# EAGLE design cvsource (EAGLE 7.2.0)
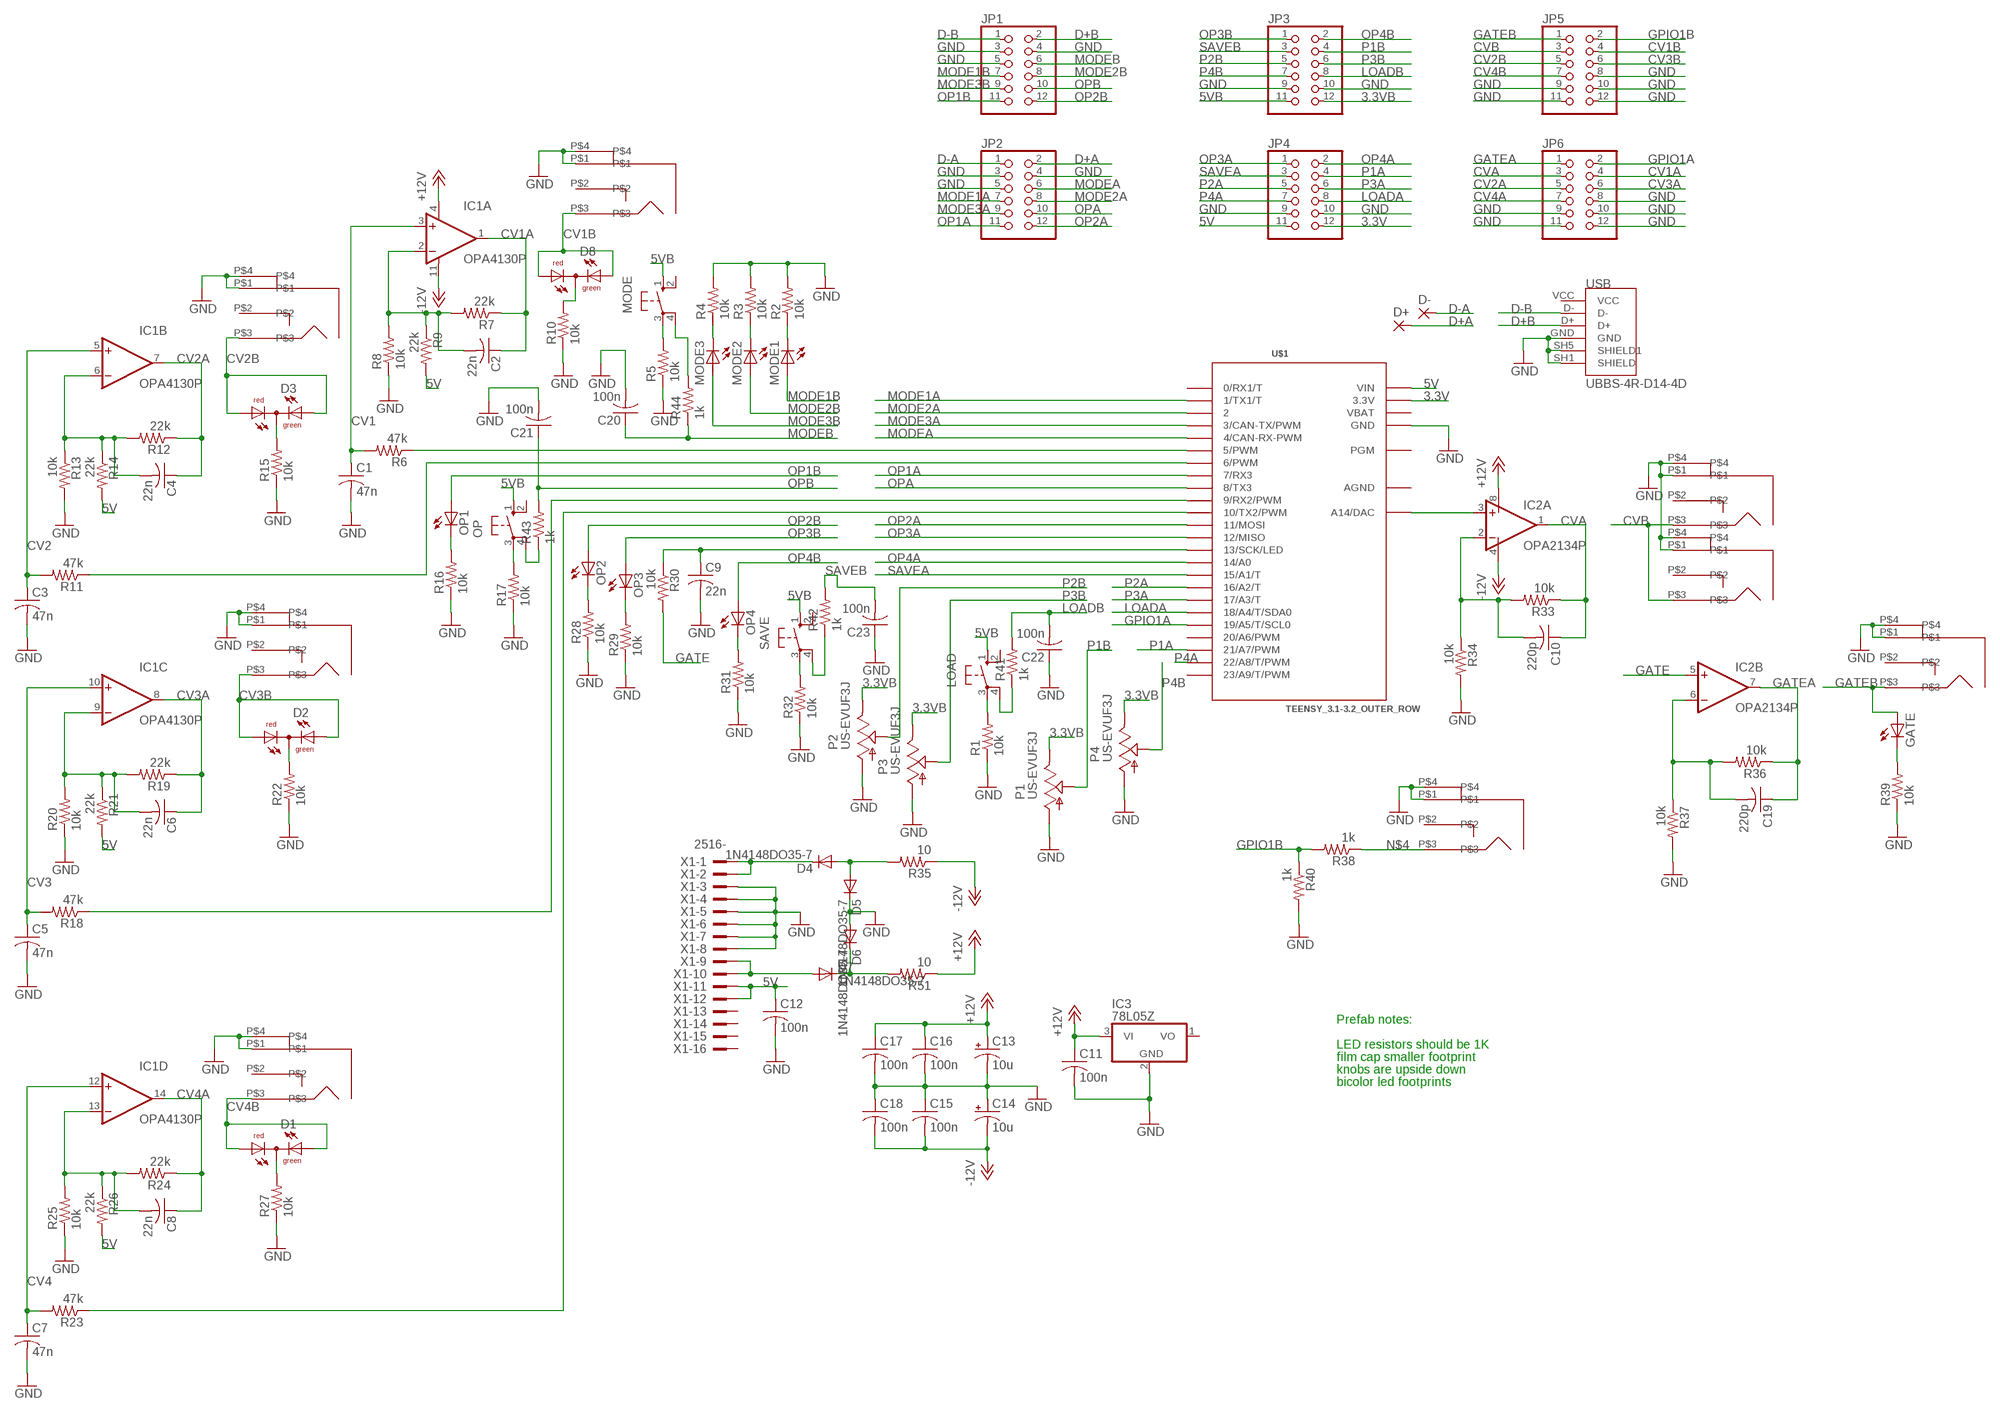
[diagram p0: schematic, sheet 1]

## Parts
C1  47n  C-US075-032X103  [C075-032X103]
C2  22n  C-US075-032X103  [C075-032X103]
C3  47n  C-US075-032X103  [C075-032X103]
C4  22n  C-US075-032X103  [C075-032X103]
C5  47n  C-US075-032X103  [C075-032X103]
C6  22n  C-US075-032X103  [C075-032X103]
C7  47n  C-US075-032X103  [C075-032X103]
C8  22n  C-US075-032X103  [C075-032X103]
C9  22n  C-US075-032X103  [C075-032X103]
C10  220p  C-US075-032X103  [C075-032X103]
C11  100n  C-US075-032X103  [C075-032X103]
C12  100n  C-US075-032X103  [C075-032X103]
C13  10u  CPOL-USE5-10.5  [E5-10,5]
C14  10u  CPOL-USE5-10.5  [E5-10,5]
C15  100n  C-US075-032X103  [C075-032X103]
C16  100n  C-US075-032X103  [C075-032X103]
C17  100n  C-US075-032X103  [C075-032X103]
C18  100n  C-US075-032X103  [C075-032X103]
C19  220p  C-US075-032X103  [C075-032X103]
C20  100n  C-US075-032X103  [C075-032X103]
C21  100n  C-US075-032X103  [C075-032X103]
C22  100n  C-US075-032X103  [C075-032X103]
C23  100n  C-US075-032X103  [C075-032X103]
CVOUT  PJ301BM  [PJ301BM]
CVOUT1  PJ301BM  [PJ301BM]
CVOUT2  PJ301BM  [PJ301BM]
CVOUT3  PJ301BM  [PJ301BM]
CVOUT4  PJ301BM  [PJ301BM]
CVOUT5  PJ301BM  [PJ301BM]
CVOUT6  PJ301BM  [PJ301BM]
CVOUT7  PJ301BM  [PJ301BM]
D1  DUOLED5MM  [DUOLED5MM]
D2  DUOLED5MM  [DUOLED5MM]
D3  DUOLED5MM  [DUOLED5MM]
D4  1N4148DO35-7  [DO35-7]
D5  1N4148DO35-7  [DO35-7]
D6  1N4148DO35-7  [DO35-7]
D7  1N4148DO35-7  [DO35-7]
D8  DUOLED5MM  [DUOLED5MM]
D+  2,0/0,9-R  [2,0/0,9-R]
D-  2,0/0,9-R  [2,0/0,9-R]
GATE  LED5MM  [LED5MM]
IC1  OPA4130P  [DIL14]
IC2  OPA2134P  [DIL08]
IC3  78L05Z  [TO92]
JP1  PINHD-2X6  [2X06]
JP2  PINHD-2X6  [2X06]
JP3  PINHD-2X6  [2X06]
JP4  PINHD-2X6  [2X06]
JP5  PINHD-2X6  [2X06]
JP6  PINHD-2X6  [2X06]
LOAD  40-XX  [B3F-40XX]
MODE  40-XX  [B3F-40XX]
MODE1  LED5MM  [LED5MM]
MODE2  LED5MM  [LED5MM]
MODE3  LED5MM  [LED5MM]
OP  40-XX  [B3F-40XX]
OP1  LED5MM  [LED5MM]
OP2  LED5MM  [LED5MM]
OP3  LED5MM  [LED5MM]
OP4  LED5MM  [LED5MM]
P1  US-EVUF3J  [EVUFXJ]
P2  US-EVUF3J  [EVUFXJ]
P3  US-EVUF3J  [EVUFXJ]
P4  US-EVUF3J  [EVUFXJ]
R1  10k  R-US_0207/2V  [0207/2V]
R2  10k  R-US_0207/2V  [0207/2V]
R3  10k  R-US_0207/2V  [0207/2V]
R4  10k  R-US_0207/2V  [0207/2V]
R5  10k  R-US_0207/2V  [0207/2V]
R6  47k  R-US_0207/2V  [0207/2V]
R7  22k  R-US_0207/2V  [0207/2V]
R8  10k  R-US_0207/2V  [0207/2V]
R9  22k  R-US_0207/2V  [0207/2V]
R10  10k  R-US_0207/2V  [0207/2V]
R11  47k  R-US_0207/2V  [0207/2V]
R12  22k  R-US_0207/2V  [0207/2V]
R13  10k  R-US_0207/2V  [0207/2V]
R14  22k  R-US_0207/2V  [0207/2V]
R15  10k  R-US_0207/2V  [0207/2V]
R16  10k  R-US_0207/2V  [0207/2V]
R17  10k  R-US_0207/2V  [0207/2V]
R18  47k  R-US_0207/2V  [0207/2V]
R19  22k  R-US_0207/2V  [0207/2V]
R20  10k  R-US_0207/2V  [0207/2V]
R21  22k  R-US_0207/2V  [0207/2V]
R22  10k  R-US_0207/2V  [0207/2V]
R23  47k  R-US_0207/2V  [0207/2V]
R24  22k  R-US_0207/2V  [0207/2V]
R25  10k  R-US_0207/2V  [0207/2V]
R26  22k  R-US_0207/2V  [0207/2V]
R27  10k  R-US_0207/2V  [0207/2V]
R28  10k  R-US_0207/2V  [0207/2V]
R29  10k  R-US_0207/2V  [0207/2V]
R30  10k  R-US_0207/2V  [0207/2V]
R31  10k  R-US_0207/2V  [0207/2V]
R32  10k  R-US_0207/2V  [0207/2V]
R33  10k  R-US_0207/2V  [0207/2V]
R34  10k  R-US_0207/2V  [0207/2V]
R35  10  R-US_0207/2V  [0207/2V]
R36  10k  R-US_0207/2V  [0207/2V]
R37  10k  R-US_0207/2V  [0207/2V]
R38  1k  R-US_0207/2V  [0207/2V]
R39  10k  R-US_0207/2V  [0207/2V]
R40  1k  R-US_0207/2V  [0207/2V]
R41  1k  R-US_0207/2V  [0207/2V]
R42  1k  R-US_0207/2V  [0207/2V]
R43  1k  R-US_0207/2V  [0207/2V]
R44  1k  R-US_0207/2V  [0207/2V]
R51  10  R-US_0207/2V  [0207/2V]
SAVE  40-XX  [B3F-40XX]
U$1  TEENSY_3.1-3.2_OUTER_ROW  [TEENSY_3.0-3.2&LC_OUTER_ROW]
USB  UBBS-4R-D14-4D  [JST_UBBS-4R-D14-4D]
X1  2516-  [PAK100/2500-16]

## Nets
3.3V: JP4.12 U$1.3.3V U$1.3.3V1(3.3V)
3.3VB: JP3.12 P1.3(E) P2.3(E) P3.3(E) P4.3(E)
5V: C12.1 JP4.11 R9.2 R14.2 R21.2 R26.2 U$1.VIN X1.11 X1.12
5VB: JP3.11 LOAD.1(S) MODE.1(S) OP.1(S) SAVE.1(S)
+12V: C11.1 C13.+ C16.1 C17.1 IC1.4(A:V+) IC2.8(P:V+) IC3.3(VI) R51.1
-12V: C14.- C15.2 C18.2 IC1.11(A:V-) IC2.4(P:V-) R35.1
CV1: C1.1 IC1.3(A:+IN) R6.2
CV1A: C2.1 IC1.1(A:OUT) JP6.4 R7.1
CV1B: CVOUT1.P$3 D8.AG D8.AR JP5.4
CV2: C3.1 IC1.5(B:+IN) R11.2
CV2A: C4.1 IC1.7(B:OUT) JP6.5 R12.1
CV2B: CVOUT2.P$3 D3.AG D3.AR JP5.5
CV3: C5.1 IC1.10(C:+IN) R18.2
CV3A: C6.1 IC1.8(C:OUT) JP6.6 R19.1
CV3B: CVOUT3.P$3 D2.AG D2.AR JP5.6
CV4: C7.1 IC1.12(D:+IN) R23.2
CV4A: C8.1 IC1.14(D:OUT) JP6.7 R24.1
CV4B: CVOUT4.P$3 D1.AG D1.AR JP5.7
CVA: C10.1 IC2.1(A:OUT) JP6.3 R33.1
CVB: CVOUT6.P$3 CVOUT.P$3 JP5.3
D+A: D+.1(P) JP2.2
D+B: JP1.2 USB.D+
D-A: D-.1(P) JP2.1
D-B: JP1.1 USB.D-
GATE: IC2.5(B:+IN) R30.2
GATEA: C19.1 IC2.7(B:OUT) JP6.1 R36.1
GATEB: CVOUT5.P$3 GATE.A JP5.1
GND: C1.2 C3.2 C5.2 C7.2 C9.2 C11.2 C12.2 C13.- C14.+ C15.1 C16.2 C17.2 C18.1 C20.2 C21.2 C22.1 C23.1 CVOUT1.P$1 CVOUT1.P$4 CVOUT2.P$1 CVOUT2.P$4 CVOUT3.P$1 CVOUT3.P$4 CVOUT4.P$1 CVOUT4.P$4 CVOUT5.P$1 CVOUT5.P$4 CVOUT6.P$1 CVOUT6.P$4 CVOUT7.P$1 CVOUT7.P$4 CVOUT.P$1 CVOUT.P$4 D5.C D6.A IC3.2(GND) JP1.3 JP1.4 JP1.5 JP2.3 JP2.4 JP2.5 JP3.9 JP3.10 JP4.9 JP4.10 JP5.8 JP5.9 JP5.10 JP5.11 JP5.12 JP6.8 JP6.9 JP6.10 JP6.11 JP6.12 P1.1(A) P2.1(A) P3.1(A) P4.1(A) R1.1 R2.2 R3.2 R4.2 R5.1 R8.1 R10.1 R13.2 R15.1 R16.1 R17.1 R20.1 R22.1 R25.1 R27.1 R28.1 R29.1 R31.1 R32.1 R34.2 R37.2 R39.1 R40.2 U$1.GND U$1.GND1(GND) USB.GND USB.SH1(SHIELD) USB.SH5(SHIELD1) X1.3 X1.4 X1.5 X1.6 X1.7 X1.8
GPIO1A: JP6.2 U$1.19/A5(19/A5/T/SCL0)
GPIO1B: JP5.2 R38.2 R40.1
LOADA: JP4.8 U$1.18/A4(18/A4/T/SDA0)
LOADB: C22.2 JP3.8 R41.2
MODE1A: JP2.7 U$1.1(1/TX1/T)
MODE1B: JP1.7 MODE1.A
MODE2A: JP2.8 U$1.2
MODE2B: JP1.8 MODE2.A
MODE3A: JP2.9 U$1.3(3/CAN-TX/PWM)
MODE3B: JP1.9 MODE3.A
MODEA: JP2.6 U$1.4(4/CAN-RX-PWM)
MODEB: C20.1 JP1.6 R44.1
N$1: MODE1.K(C) R2.1
N$2: MODE2.K(C) R3.1
N$3: MODE3.K(C) R4.1
N$4: CVOUT7.P$3 R38.1
N$5: C19.2 IC2.6(B:-IN) R36.2 R37.1
N$6: GATE.K(C) R39.2
N$7: LOAD.4(P1) R41.1
N$8: MODE.3(P) R5.2
N$9: R6.1 U$1.5(5/PWM)
N$10: OP1.K(C) R16.2
N$11: C2.2 IC1.2(A:-IN) R7.2 R8.2 R9.1
N$12: R42.1 SAVE.4(P1)
N$13: D8.K(C) R10.2
N$14: R11.1 U$1.6(6/PWM)
N$15: C4.2 IC1.6(B:-IN) R12.2 R13.1 R14.1
N$16: OP.4(P1) R43.1
N$17: D3.K(C) R15.2
N$18: MODE.4(P1) R44.2
N$19: D1.K(C) R27.2
N$20: OP.3(P) R17.2
N$21: R18.1 U$1.9(9/RX2/PWM)
N$22: C6.2 IC1.9(C:-IN) R19.2 R20.2 R21.1
N$24: D2.K(C) R22.2
N$25: OP4.K(C) R31.2
N$26: R23.1 U$1.10(10/TX2/PWM)
N$27: C8.2 IC1.13(D:-IN) R24.2 R25.2 R26.1
N$30: OP2.K(C) R28.2
N$32: OP3.K(C) R29.2
N$34: C9.1 R30.1 U$1.13(13/SCK/LED)
N$37: R32.2 SAVE.3(P)
N$41: LOAD.3(P) R1.2
N$44: IC2.3(A:+IN) U$1.RESET/DAC(A14/DAC)
N$45: C10.2 IC2.2(A:-IN) R33.2 R34.1
N$47: D6.C D7.C R51.2
N$48: D4.A D5.A R35.2
N$71: D7.A X1.9 X1.10
N$72: D4.C X1.1 X1.2
OP1A: JP2.11 U$1.7(7/RX3)
OP1B: JP1.11 OP1.A
OP2A: JP2.12 U$1.11(11/MOSI)
OP2B: JP1.12 OP2.A
OP3A: JP4.1 U$1.12(12/MISO)
OP3B: JP3.1 OP3.A
OP4A: JP4.2 U$1.14/A0
OP4B: JP3.2 OP4.A
OPA: JP2.10 U$1.8(8/TX3)
OPB: C21.1 JP1.10 R43.2
P1A: JP4.4 U$1.21/A7(21/A7/PWM)
P1B: JP3.4 P1.2(S)
P2A: JP4.5 U$1.16/A2(16/A2/T)
P2B: JP3.5 P2.2(S)
P3A: JP4.6 U$1.17/A3(17/A3/T)
P3B: JP3.6 P3.2(S)
P4A: JP4.7 U$1.22/A8(22/A8/T/PWM)
P4B: JP3.7 P4.2(S)
SAVEA: JP4.3 U$1.15/A1(15/A1/T)
SAVEB: C23.2 JP3.3 R42.2
Unconnected: CVOUT1.P$2 CVOUT2.P$2 CVOUT3.P$2 CVOUT4.P$2 CVOUT5.P$2 CVOUT6.P$2 CVOUT7.P$2 CVOUT.P$2 IC3.1(VO) LOAD.2(S1) MODE.2(S1) OP.2(S1) SAVE.2(S1) U$1.0(0/RX1/T) U$1.20/A6(20/A6/PWM) U$1.23/A9(23/A9/T/PWM) U$1.PGM USB.VCC X1.13 X1.14 X1.15 X1.16

## Notes on the sheet
- Prefab notes:
- LED resistors should be 1K
- film cap smaller footprint
- knobs are upside down
- bicolor led footprints

## Power pins joined to a net without a drawn wire
AGND: U$1.AGND
VBAT: U$1.VBAT

## Library data of the parts
C1-C12 C15-C23 = dan:C-US: CAPACITOR, American symbol
C13 C14 = dan:CPOL-US: POLARIZED CAPACITOR, American symbol
CVOUT CVOUT1-CVOUT7 = dan:PJ301BM
D1-D3 D8 = dan:DUOLED5MM: DUO LED 2 colors, 5 mm, round
D4-D7 = dan:1N4148: DIODE high speed (Philips)
D+ D- = synthdiy:2,0/0,9-R: ROUND THROUGH-HOLE PAD 2.0 mm, 0.9 mm/0.079",0.035"
GATE MODE1-MODE3 OP1-OP4 = dan:LED: LED OSRAM: - CHIPLED LG R971, LG N971, LY N971, LG Q971, LY Q971, LO R971, LY R971 LH N974, LH R974 LS Q976, LO Q976, LY Q976 LO Q996 - Hyper CHIPLED LW Q18S LB Q993, LB Q99A, LB R99A - SideLED LS A670, LO A670, LY A670, LG A670, LP A670 LB A673, LV A673, LT A673, LW A673 LH A674 LY A675 LS A676, LA A676, LO A676, LY A676, LW A676 LS A679, LY A679, LG A679 - Hyper Micro SIDELED® LS Y876, LA Y876, LO Y876, LY Y876 LT Y87S - SmartLED LW L88C, LW L88S LB L89C, LB L89S, LG L890 LS L89K, LO L89K, LY L89K LS L896, LA L896, LO L896, LY L896 - TOPLED LS T670, LO T670, LY T670, LG T670, LP T670 LSG T670, LSP T670, LSY T670, LOP T670, LYG T670 LG T671, LOG T671, LSG T671 LB T673, LV T673, LT T673, LW T673 LH T674 LS T676, LA T676, LO T676, LY T676, LB T676, LH T676, LSB T676, LW T676 LB T67C, LV T67C, LT T67C, LS T67K, LO T67K, LY T67K, LW E67C LS E67B, LA E67B, LO E67B, LY E67B, LB E67C, LV E67C, LT E67C LW T67C LS T679, LY T679, LG T679 LS T770, LO T770, LY T770, LG T770, LP T770 LB T773, LV T773, LT T773, LW T773 LH T774 LS E675, LA E675, LY E675, LS T675 LS T776, LA T776, LO T776, LY T776, LB T776 LHGB T686 LT T68C, LB T68C - Hyper Mini TOPLED® LB M676 - Mini TOPLED Santana® LG M470 LS M47K, LO M47K, LY M47K Source: http://www.osram.convergy.de LUXEON: - LUMILED® LXK2-PW12-R00, LXK2-PW12-S00, LXK2-PW14-U00, LXK2-PW14-V00 LXK2-PM12-R00, LXK2-PM12-S00, LXK2-PM14-U00 LXK2-PE12-Q00, LXK2-PE12-R00, LXK2-PE12-S00, LXK2-PE14-T00, LXK2-PE14-U00 LXK2-PB12-K00, LXK2-PB12-L00, LXK2-PB12-M00, LXK2-PB14-N00, LXK2-PB14-P00, LXK2-PB14-Q00 LXK2-PR12-L00, LXK2-PR12-M00, LXK2-PR14-Q00, LXK2-PR14-R00 LXK2-PD12-Q00, LXK2-PD12-R00, LXK2-PD12-S00 LXK2-PH12-R00, LXK2-PH12-S00 LXK2-PL12-P00, LXK2-PL12-Q00, LXK2-PL12-R00 Source: www.luxeon.com KINGBRIGHT: KA-3528ASYC Source: www.kingbright.com
IC1 = dan:OPA4130: Low Power, Precision FET-Input Operational Amplifiers; OC_FARNELL: unknown; OC_NEWARK: unknown
IC2 = dan:OPA2134: SoundPLUS (TM) High Performance AUDIO OPERATIONAL AMPLIFIERS Source: http://focus.ti.com/lit/ds/sbos058/sbos058.pdf
IC3 = dan:78*: Positive VOLTAGE REGULATOR Source: http://cache.national.com/ds/LM/LM78L05.pdf http://www.fairchildsemi.com/ds/LM/LM7805.pdf
JP1-JP6 = dan:PINHD-2X6: PIN HEADER
LOAD MODE OP SAVE = switch-omron:40-XX: OMRON SWITCH; MF: OMRON COMPONENTS USA; MPN: B3F-4000; OC_FARNELL: 176434; OC_NEWARK: 36K3105
P1-P4 = dan:US-EVU: 9 mm Square Rotary Potentiometers Source: Panasonic
R1-R44 R51 = dan:R-US_: RESISTOR, American symbol
U$1 = Teensy_3_and_LC_Series_Boards_v1.4:TEENSY_3.1-3.2_OUTER_ROW: Footprint for Teensy 3.1 or 3.2 board using all pin connections on the outer perimeter
USB = UBBS-4R-D14-4D:UBBS-4R-D14-4D: Socket; USB B; on PCBs; THT; PIN: 4; straight; V: USB 2.0; AVAILABILITY: Unavailable; DESCRIPTION: Socket; USB B; on PCBs; THT; PIN: 4; straight; V: USB 2.0; MF: JST; MP: UBBS-4R-D14-4D; PACKAGE: None; PRICE: None
X1 = dan:2516-: 3M (TM) Pak 100 4-Wall Header Source: 3M; OC_FARNELL: unknown; OC_NEWARK: unknown

## Board
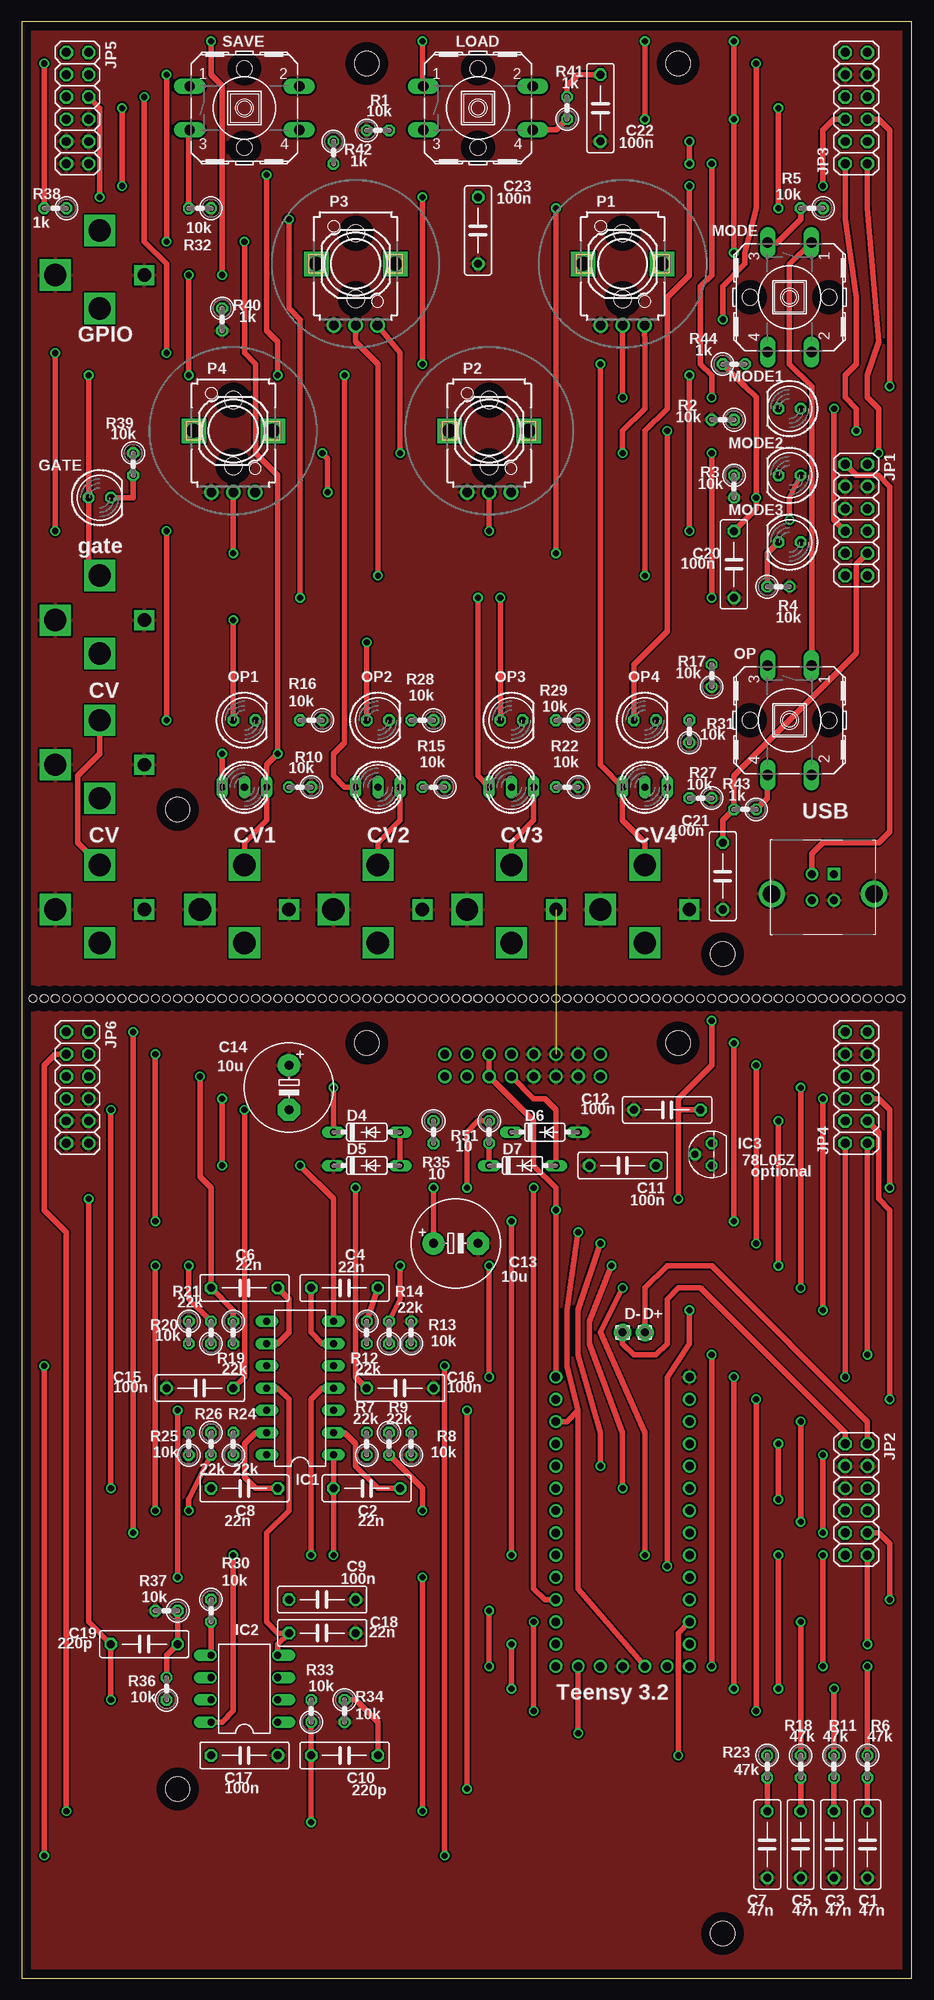
[diagram p1: board, top side]
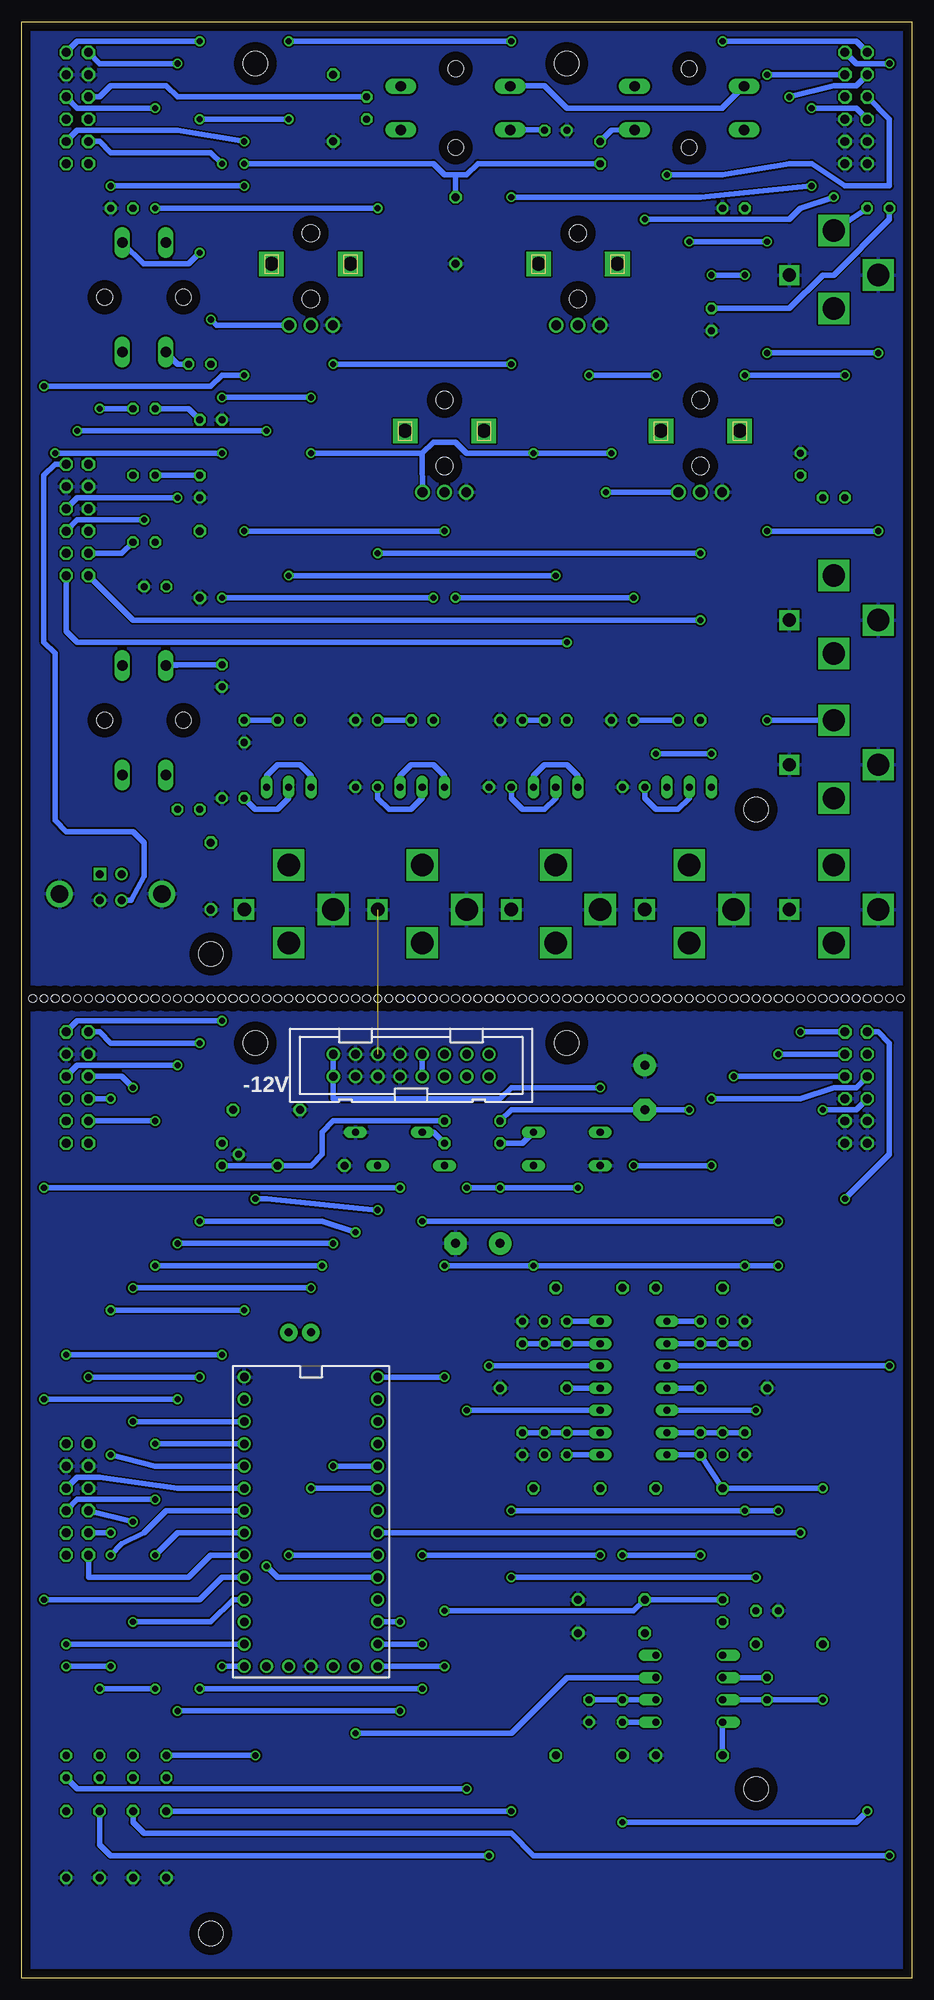
[diagram p2: board, bottom side, seen from below]

Size 101.58 x 223.19 mm. Coordinates in mm from the lower left corner, seen from the top.
Outline: 0,0 101.58,0 101.58,223.19 0,223.19 0,0
Copper layers (1*16): Top 0.035mm / dielectric 1.5mm / Bottom 0.035mm
Design rules "default": minimum track width 10mil, minimum drill 24mil, track to track 8mil, track to pad 8mil, pad to pad 8mil, via to via 8mil, smd to smd 8mil, copper to edge 40mil, drill to drill 8mil, minimum pad ring 10mil, minimum via ring 8mil, stop-mask expansion 4mil, vias tented up to drill 0mil, thermal gap 10mil
Holes 2.8 mm at 80.01,5.08 17.78,21.59 17.78,133.35 80.01,116.84 74.93,218.44 74.93,106.68 39.37,106.68 39.37,218.44
Holes 0.9 mm at 1.27,111.76 2.54,111.76 3.81,111.76 5.08,111.76 6.35,111.76 7.62,111.76 8.89,111.76 10.16,111.76 11.43,111.76 12.7,111.76 13.97,111.76 15.24,111.76 16.51,111.76 17.78,111.76 19.05,111.76 20.32,111.76 21.59,111.76 22.86,111.76 24.13,111.76 25.4,111.76 26.67,111.76 27.94,111.76 29.21,111.76 30.48,111.76 31.75,111.76 33.02,111.76 34.29,111.76 35.56,111.76 36.83,111.76 38.1,111.76 39.37,111.76 40.64,111.76 41.91,111.76 43.18,111.76 44.45,111.76 45.72,111.76 46.99,111.76 48.26,111.76 49.53,111.76 50.8,111.76 52.07,111.76 53.34,111.76 54.61,111.76 55.88,111.76 57.15,111.76 58.42,111.76 59.69,111.76 60.96,111.76 62.23,111.76 63.5,111.76 64.77,111.76 66.04,111.76 67.31,111.76 68.58,111.76 69.85,111.76 71.12,111.76 72.39,111.76 73.66,111.76 74.93,111.76 76.2,111.76 77.47,111.76 78.74,111.76 80.01,111.76 81.28,111.76 82.55,111.76 83.82,111.76 85.09,111.76 86.36,111.76 87.63,111.76 88.9,111.76 90.17,111.76 91.44,111.76 92.71,111.76 93.98,111.76 95.25,111.76 96.52,111.76 97.79,111.76 99.06,111.76 100.33,111.76

### Footprints (pad centres in the part's own frame; a part is rotated, then mirrored left to right if it is on the bottom)
C075-032X103 = drill 0.914 octagon: 1 -3.81,0; 2 3.81,0
E5-10,5 = drill 1.016 pad 2.54: + -2.54,0 | drill 1.016 pad 2.54 octagon: - 2.54,0
PJ301BM = drill 1.524 square: P$1 5.08,0 | drill 2.54 square: P$2 0,-3.81; P$3 0,5.08; P$4 -5.08,0
DUOLED5MM = drill 0.813 long: AG -2.54,0; AR 2.54,0; K 0,0
DO35-7 = drill 0.813 long: A 3.81,0; C -3.81,0
2,0/0,9-R = drill 0.914 pad 2: 1 0,0
LED5MM = drill 0.813 octagon: A -1.27,0; K 1.27,0
DIL14 = drill 0.813 long: 1 -7.62,-3.81; 2 -5.08,-3.81; 3 -2.54,-3.81; 4 0,-3.81; 5 2.54,-3.81; 6 5.08,-3.81; 7 7.62,-3.81; 8 7.62,3.81; 9 5.08,3.81; 10 2.54,3.81; 11 0,3.81; 12 -2.54,3.81; 13 -5.08,3.81; 14 -7.62,3.81
DIL08 = drill 0.813 offset: 1 -3.81,-3.81; 2 -1.27,-3.81; 3 1.27,-3.81; 4 3.81,-3.81; 5 3.81,3.81; 6 1.27,3.81; 7 -1.27,3.81; 8 -3.81,3.81
TO92 = drill 0.813 octagon: 1 1.27,0; 2 0,1.905; 3 -1.27,0
2X06 = drill 1.016 octagon: 1 -6.35,-1.27; 2 -6.35,1.27; 3 -3.81,-1.27; 4 -3.81,1.27; 5 -1.27,-1.27; 6 -1.27,1.27; 7 1.27,-1.27; 8 1.27,1.27; 9 3.81,-1.27; 10 3.81,1.27; 11 6.35,-1.27; 12 6.35,1.27
B3F-40XX = drill 1.194 long: 1 -6.248,2.489; 2 6.248,2.489; 3 -6.248,-2.489; 4 6.248,-2.489 | hole 1.803: 0,-4.496; 0,4.496
EVUFXJ = drill 1.1 pad 1.676: 1 -2.5,-7; 2 0,-7; 3 2.5,-7 | drill 1.6 pad 2.8 square: M1 4.5,0; M2 -4.5,0 | hole 2: 0,3.5; 0,-4
0207/2V = drill 0.813 octagon: 1 -1.27,0; 2 1.27,0
TEENSY_3.0-3.2&LC_OUTER_ROW = drill 0.965: 0 -7.62,13.97; 1 -7.62,11.43; 2 -7.62,8.89; 3 -7.62,6.35; 3.3V 7.62,11.43; 3.3V1 -2.54,-16.51; 4 -7.62,3.81; 5 -7.62,1.27; 6 -7.62,-1.27; 7 -7.62,-3.81; 8 -7.62,-6.35; 9 -7.62,-8.89; 10 -7.62,-11.43; 11 -7.62,-13.97; 12 -7.62,-16.51; 13 7.62,-16.51; 14/A0 7.62,-13.97; 15/A1 7.62,-11.43; 16/A2 7.62,-8.89; 17/A3 7.62,-6.35; 18/A4 7.62,-3.81; 19/A5 7.62,-1.27; 20/A6 7.62,1.27; 21/A7 7.62,3.81; 22/A8 7.62,6.35; 23/A9 7.62,8.89; AGND 7.62,13.97; GND -7.62,16.51; GND1 0,-16.51; PGM 2.54,-16.51; RESET/DAC 5.08,-16.51; VBAT -5.08,-16.51; VIN 7.62,16.51
JST_UBBS-4R-D14-4D = drill 0.92: D+ -1.25,-1.5; D- -1.25,1.5; GND 1.25,-1.5 | drill 2: SH1 -5.834,-0.758; SH5 5.85,-0.758 | drill 0.92 square: VCC 1.25,1.5
PAK100/2500-16 = drill 1 pad 1.422: 1 -8.89,-1.27; 2 -8.89,1.27; 3 -6.35,-1.27; 4 -6.35,1.27; 5 -3.81,-1.27; 6 -3.81,1.27; 7 -1.27,-1.27; 8 -1.27,1.27; 9 1.27,-1.27; 10 1.27,1.27; 11 3.81,-1.27; 12 3.81,1.27; 13 6.35,-1.27; 14 6.35,1.27; 15 8.89,-1.27; 16 8.89,1.27

### Placement (x,y rotation side)
C1  96.52,15.24 270 top
C2  39.37,55.88 0 top
C3  92.71,15.24 270 top
C4  36.83,78.74 180 top
C5  88.9,15.24 270 top
C6  25.4,78.74 0 top
C7  85.09,15.24 270 top
C8  25.4,55.88 0 top
C9  34.29,43.18 0 top
C10  36.83,25.4 0 top
C11  68.58,92.71 180 top
C12  73.66,99.06 180 top
C13  49.53,83.82 0 top
C14  30.48,101.6 270 top
C15  20.32,67.31 0 top
C16  43.18,67.31 0 top
C17  25.4,25.4 0 top
C18  34.29,39.37 180 top
C19  13.97,38.1 0 top
C20  81.28,161.29 270 top
C21  80.01,125.73 270 top
C22  66.04,213.36 90 top
C23  52.07,199.39 90 top
CVOUT  8.89,138.43 0 top
CVOUT1  25.4,121.92 0 top
CVOUT2  40.64,121.92 0 top
CVOUT3  55.88,121.92 0 top
CVOUT4  71.12,121.92 0 top
CVOUT5  8.89,154.94 0 top
CVOUT6  8.89,121.92 0 top
CVOUT7  8.89,194.31 0 top
D1  71.12,135.89 0 top
D2  55.88,135.89 0 top
D3  40.64,135.89 0 top
D4  39.37,96.52 0 top
D5  39.37,92.71 0 top
D6  59.69,96.52 0 top
D7  57.15,92.71 0 top
D8  25.4,135.89 0 top
D+  71.12,73.66 0 top
D-  68.58,73.66 0 top
GATE  8.89,168.91 0 top
IC1  31.75,67.31 90 top
IC2  25.4,33.02 90 top
IC3  78.74,93.98 90 top
JP1  95.25,166.37 270 top
JP2  95.25,54.61 270 top
JP3  95.25,213.36 90 top
JP4  95.25,101.6 90 top
JP5  6.35,213.36 270 top
JP6  6.35,101.6 270 top
LOAD  52.07,213.36 0 top
MODE  87.63,191.77 270 top
MODE1  87.63,179.07 180 top
MODE2  87.63,171.45 180 top
MODE3  87.63,163.83 180 top
OP  87.63,143.51 270 top
OP1  25.4,143.51 0 top
OP2  40.64,143.51 0 top
OP3  55.88,143.51 0 top
OP4  71.12,143.51 0 top
P1  68.58,195.58 0 top
P2  53.34,176.53 0 top
P3  38.1,195.58 0 top
P4  24.13,176.53 0 top
R1  40.64,210.82 0 top
R2  80.01,177.8 180 top
R3  81.28,170.18 270 top
R4  86.36,158.75 0 top
R5  90.17,201.93 180 top
R6  96.52,24.13 270 top
R7  39.37,60.96 90 top
R8  44.45,60.96 90 top
R9  41.91,60.96 270 top
R10  31.75,135.89 180 top
R11  92.71,24.13 270 top
R12  39.37,73.66 270 top
R13  44.45,73.66 90 top
R14  41.91,73.66 90 top
R15  46.99,135.89 180 top
R16  33.02,143.51 180 top
R17  78.74,148.59 90 top
R18  88.9,24.13 270 top
R19  24.13,73.66 270 top
R20  19.05,73.66 270 top
R21  21.59,73.66 90 top
R22  62.23,135.89 180 top
R23  85.09,24.13 270 top
R24  24.13,60.96 90 top
R25  19.05,60.96 90 top
R26  21.59,60.96 270 top
R27  77.47,134.62 180 top
R28  45.72,143.51 180 top
R29  62.23,143.51 180 top
R30  21.59,41.91 270 top
R31  76.2,142.24 90 top
R32  20.32,201.93 180 top
R33  33.02,30.48 90 top
R34  36.83,30.48 270 top
R35  46.99,96.52 270 top
R36  16.51,33.02 90 top
R37  16.51,41.91 180 top
R38  3.81,201.93 180 top
R39  12.7,172.72 270 top
R40  22.86,189.23 270 top
R41  62.23,213.36 90 top
R42  35.56,208.28 270 top
R43  82.55,133.35 180 top
R44  81.28,184.15 0 top
R51  53.34,96.52 270 top
SAVE  25.4,213.36 0 top
U$1  68.58,52.07 0 bottom
USB  91.44,124.46 0 top
X1  57.15,104.14 0 bottom

### Tracks (layer width: path | path; a pad name or v marks a point on that pad's centre or on a via)
3.3V  (via drill 0.7)
  Top 0.61: U$1.3.3V 62.23,63.5 63.5,64.77 | v81.28,86.36 v81.28,106.68 | U$1.3.3V1 63.5,44.45 63.5,64.77 | 63.5,64.77 62.23,69.85 62.23,76.2 v63.5,85.09
  Bottom 0.61: JP4.12 92.71,107.95 91.44,106.68 v81.28,106.68 | v81.28,86.36 67.31,86.36 v63.5,85.09
3.3VB  (via drill 0.7)
  Top 0.61: P3.3 43.14,185.46 43.18,185.42 v43.18,173.99 | v34.91,169.53 34.91,173.34 v34.29,173.99 | v68.58,173.99 68.58,176.53 71.12,179.07 71.12,186 P1.3 | v80.01,189.23 80.01,193.04 82.55,195.58 82.55,196.85 83.82,201.93 v83.82,218.44
  Bottom 0.61: P1.3 79.36,188.58 v80.01,189.23 | v83.82,218.44 92.71,218.44 JP3.12 | 55.88,173.99 55.88,173.38 P2.3 | 55.88,173.99 v68.58,173.99 | 55.88,173.99 54.61,175.26 52.07,175.26 50.8,173.99 v43.18,173.99 v34.29,173.99 | P4.3 v34.91,169.53
5V  (via drill 0.7)
  Top 0.61: U$1.VIN v60.96,87.63 60.96,90.17 58.42,92.71 58.42,97.79 X1.11 X1.12 | R14.2 43.18,77.47 v43.18,81.28 | R9.2 45.72,55.88 v45.72,53.34 | v19.05,53.34 19.05,54.61 R26.2 | v15.24,81.28 v15.24,53.34 | R21.2 19.05,77.47 v19.05,81.28 | v53.34,68.58 v53.34,81.28 | v78.74,109.22 78.74,104.14 74.93,100.33 74.93,99.06 | 74.93,99.06 v74.93,88.9 | C12.1 74.93,99.06
  Bottom 0.61: JP4.11 95.25,109.22 v78.74,109.22 | v45.72,53.34 v19.05,53.34 v15.24,53.34 | v15.24,81.28 v19.05,81.28 v43.18,81.28 v53.34,81.28 | U$1.VIN v53.34,68.58 | v74.93,88.9 73.66,88.9 v60.96,87.63
5VB  (via drill 0.7)
  Top 0.61: v45.72,220.98 45.72,215.95 LOAD.1 | OP.1 90.12,149.91 90.17,151.13 90.17,181.61 87.63,184.15 87.63,195.53 MODE.1 90.27,198.02 | v81.28,196.85 v81.28,212.09 v81.28,220.98 | v71.12,220.98 v71.12,212.09
  Bottom 0.61: JP3.11 95.25,220.98 v81.28,220.98 | v45.72,220.98 v71.12,220.98 | v71.12,212.09 v81.28,212.09 | MODE.1 87.68,195.58 82.55,195.58 v81.28,196.85 | SAVE.1 21.59,213.41 21.59,213.36 39.37,213.36 41.91,215.9 45.77,215.9 LOAD.1
+12V  (via drill 0.7)
  Top 0.61: C16.1 38.1,68.58 v38.1,90.17 | v50.8,90.17 50.8,96.52 52.07,97.79 R51.1 | IC1.4 34.29,67.31 33.02,66.04 v33.02,48.26 | v24.13,48.26 24.13,30.48 22.86,29.21 IC2.8 | C13.+ v46.99,90.17
  Bottom 0.61: IC3.3 C11.1 68.58,92.71 67.31,93.98 67.31,96.52 66.04,97.79 R51.1 | C17.1 IC2.8 | IC1.4 C16.1 | v38.1,90.17 v46.99,90.17 v50.8,90.17 | v33.02,48.26 v24.13,48.26
-12V  (via drill 0.7)
  Top 0.61: IC2.4 29.21,38.1 C18.2 29.21,39.37 27.94,40.64 27.94,50.8 30.48,53.34 30.48,66.04 29.21,67.31 IC1.11 | v25.4,99.06 25.4,68.58 C15.2
  Bottom 0.61: R35.1 45.72,99.06 C14.- v25.4,99.06 | IC1.11 C15.2
CV1  (via drill 0.7)
  Top 0.61: C1.1 R6.2 | v50.8,21.59 v50.8,64.77
  Bottom 0.61: R6.2 95.25,21.59 v50.8,21.59 | v50.8,64.77 IC1.3
CV1A  (via drill 0.7)
  Top 0.61: v35.56,48.26 C2.1 IC1.1 | v55.88,48.26 v55.88,86.36 | v15.24,86.36 v15.24,105.41
  Bottom 0.61: IC1.1 R7.1 | v35.56,48.26 v55.88,48.26 | v55.88,86.36 v15.24,86.36 | v15.24,105.41 JP6.4
CV1B  (via drill 0.7)
  Top 0.61: v16.51,217.17 v16.51,198.12 | v22.86,139.7 D8.AG | CVOUT1.P$3 25.4,129.54 27.94,132.08 D8.AR 27.94,138.43 v29.21,139.7 29.21,171.45 26.67,173.99 26.67,184.15 25.4,185.42 v25.4,198.12
  Bottom 0.61: JP5.4 v16.51,217.17 | v16.51,198.12 v25.4,198.12 | v29.21,139.7 v22.86,139.7
CV2  (via drill 0.7)
  Top 0.61: R11.2 C3.1 | v48.26,13.97 v48.26,69.85
  Bottom 0.61: C3.1 92.71,15.24 91.44,13.97 v48.26,13.97 | v48.26,69.85 IC1.5
CV2A  (via drill 0.7)
  Top 0.61: C4.1 R12.1 | IC1.7 35.56,88.9 v31.75,92.71 | v22.86,92.71 v22.86,100.33
  Bottom 0.61: R12.1 IC1.7 | v31.75,92.71 v22.86,92.71 | JP6.5 6.35,101.6 8.89,101.6 12.7,100.33 v22.86,100.33
CV2B  (via drill 0.7)
  Top 0.61: D3.AR 43.18,132.08 40.64,129.54 CVOUT2.P$3 | D3.AG 36.83,135.89 35.56,137.16 35.56,139.7 36.83,140.97 v36.83,182.88 | v29.21,182.88 29.21,186.69 27.94,187.96 v27.94,205.74
  Bottom 0.61: D3.AR 43.18,137.16 41.91,138.43 39.37,138.43 38.1,137.16 D3.AG | v36.83,182.88 v29.21,182.88 | JP5.5 2.54,212.09 2.54,204.47 7.62,204.47 11.43,207.01 13.97,207.01 21.59,205.74 v27.94,205.74
CV3  (via drill 0.7)
  Top 0.61: R18.2 C5.1 | v2.54,13.97 v2.54,69.85
  Bottom 0.61: C5.1 88.9,17.78 87.63,16.51 45.72,16.51 43.18,13.97 v2.54,13.97 | v2.54,69.85 IC1.10
CV3A  (via drill 0.7)
  Top 0.61: R19.1 24.13,76.2 C6.1 21.59,90.17 20.32,91.44 v20.32,102.87
  Bottom 0.61: IC1.8 R19.1 | v20.32,102.87 JP6.6
CV3B  (via drill 0.7)
  Top 0.61: v52.07,157.48 52.07,137.16 D2.AG | v8.89,203.2 8.89,213.36 JP5.6 | v30.48,200.66 30.48,190.5 31.75,189.23 v31.75,157.48 | D2.AR 58.42,132.08 55.88,129.54 CVOUT3.P$3
  Bottom 0.61: v52.07,157.48 v31.75,157.48 | D2.AR 58.42,137.16 57.15,138.43 54.61,138.43 53.34,137.16 D2.AG | v30.48,200.66 13.97,200.66 12.7,201.93 v8.89,203.2
CV4  (via drill 0.7)
  Top 0.61: R23.2 C7.1 | v45.72,19.05 v45.72,45.72 | v17.78,45.72 v17.78,64.77
  Bottom 0.61: C7.1 v45.72,19.05 | v45.72,45.72 v17.78,45.72 | v17.78,64.77 IC1.12
CV4A  (via drill 0.7)
  Top 0.61: v10.16,55.88 v10.16,99.06
  Bottom 0.61: IC1.14 R24.1 C8.1 v10.16,55.88 | v10.16,99.06 6.35,99.06 JP6.7
CV4B  (via drill 0.7)
  Top 0.61: v11.43,204.47 v11.43,213.36 | v66.04,184.15 66.04,138.43 D1.AG 68.58,132.08 71.12,129.54 CVOUT4.P$3 | v45.72,184.15 v45.72,203.2
  Bottom 0.61: v11.43,213.36 6.35,213.36 JP5.7 | v66.04,184.15 v45.72,184.15 | D1.AR 73.66,137.16 72.39,138.43 69.85,138.43 68.58,137.16 D1.AG | v45.72,203.2 24.13,203.2 v11.43,204.47
CVA  (via drill 0.7)
  Top 0.61: v5.08,19.05 5.08,85.09 2.54,87.63 2.54,104.14 3.81,105.41 JP6.3 | v33.02,17.78 C10.1 R33.1
  Bottom 0.61: IC2.1 R33.1 | v5.08,19.05 6.35,17.78 v33.02,17.78
CVB  (via drill 0.7)
  Top 0.61: CVOUT6.P$3 6.35,129.54 6.35,137.16 8.89,139.7 CVOUT.P$3 | v16.51,143.51 v16.51,165.1 | v3.81,165.1 v3.81,185.42 | v16.51,185.42 16.51,195.58 13.97,198.12 v13.97,214.63
  Bottom 0.61: JP5.3 6.35,215.9 8.89,215.9 v13.97,214.63 | v16.51,143.51 CVOUT.P$3 | v16.51,165.1 v3.81,165.1 | v3.81,185.42 v16.51,185.42
D+A
  Top 0.61: JP2.2 96.52,63.5 78.74,81.28 73.66,81.28 71.12,78.74 D+.1
D+B
  Bottom 0.61: USB.D+ 89.13,122.96 87.63,125.73 87.63,129.54 88.9,130.81 96.52,130.81 97.79,132.08 97.79,151.13 99.06,152.4 99.06,171.45 97.79,172.72 JP1.2
D-A
  Top 0.61: JP2.1 93.98,62.23 77.47,78.74 74.93,78.74 73.66,77.47 73.66,72.39 72.39,71.12 69.85,71.12 68.58,72.39 D-.1
D-B
  Top 0.61: USB.D- 90.19,128.29 91.44,129.54 97.79,129.54 99.06,130.81 99.06,170.18 97.79,171.45 95.25,171.45 JP1.1
GATE
  Top 0.61: IC2.5 R30.2
GATEA  (via drill 0.7)
  Top 0.61: v10.16,31.75 C19.1 7.62,40.64 v7.62,88.9
  Bottom 0.61: IC2.7 R36.1 v10.16,31.75 | v7.62,88.9 2.54,93.98 2.54,106.68 3.81,107.95 JP6.1
GATEB  (via drill 0.7)
  Top 0.61: v22.86,194.31 22.86,215.9 21.59,217.17 v21.59,220.98 | v19.05,182.88 v19.05,194.31 | v7.62,182.88 GATE.A 7.62,161.29 CVOUT5.P$3
  Bottom 0.61: JP5.1 6.35,220.98 v21.59,220.98 | v19.05,194.31 v22.86,194.31 | v7.62,182.88 v19.05,182.88
GND  (1 unrouted)
  pour Top: -2.54,226.06 104.14,226.06 104.14,-2.54 -2.54,-2.54
  pour Bottom: -1.27,224.79 102.87,224.79 102.87,-1.27 -1.27,-1.27
GPIO1A  (via drill 0.7)
  Top 0.61: v12.7,50.8 v12.7,107.95
  Bottom 0.61: U$1.19/A5 v12.7,50.8 | v12.7,107.95 JP6.2
GPIO1B  (via drill 0.7)
  Top 0.61: R38.2 v2.54,218.44
  Bottom 0.61: JP5.2 6.35,218.44 v2.54,218.44 | R40.1 13.97,190.5 10.16,194.31 8.89,194.31 2.54,200.66 R38.2
LOADA  (via drill 0.7)
  Top 0.61: v88.9,78.74 v88.9,101.6 | v71.12,48.26 71.12,62.23 66.04,73.66 v68.58,78.74
  Bottom 0.61: U$1.18/A4 v71.12,48.26 | v68.58,78.74 v88.9,78.74 | v88.9,101.6 90.17,102.87 JP4.8
LOADB
  Top 0.61: C22.2 63.5,217.17 62.23,215.9 R41.2
  Bottom 0.61: R41.2 83.82,214.63 85.09,215.9 91.44,215.9 92.71,214.63 JP3.8
MODE1A  (via drill 0.7)
  Top 0.61: v88.9,52.07 v88.9,63.5
  Bottom 0.61: JP2.7 v88.9,52.07 | v88.9,63.5 U$1.1
MODE1B  (via drill 0.7)
  Top 0.61: v92.71,179.07 92.71,166.37 JP1.7
  Bottom 0.61: MODE1.A v92.71,179.07
MODE2A  (via drill 0.7)
  Top 0.61: v86.36,54.61 v86.36,60.96
  Bottom 0.61: JP2.8 95.25,54.61 v86.36,54.61 | v86.36,60.96 U$1.2
MODE2B  (via drill 0.7)
  Top 0.61: MODE2.A 87.63,168.91 v87.63,166.37
  Bottom 0.61: JP1.8 95.25,166.37 v87.63,166.37
MODE3A  (via drill 0.7)
  Top 0.61: v91.44,50.8 v91.44,59.69
  Bottom 0.61: JP2.9 v91.44,50.8 | U$1.3 86.36,58.42 v91.44,59.69
MODE3B
  Bottom 0.61: JP1.9 90.17,162.56 MODE3.A
MODEA
  Bottom 0.61: JP2.6 95.25,57.15 92.71,57.15 83.82,55.88 U$1.4
MODEB  (via drill 0.7)
  Top 0.61: R44.1 82.55,181.61 83.82,180.39 v83.82,168.91 83.82,167.64 C20.1
  Bottom 0.61: JP1.6 95.25,168.91 v83.82,168.91
N$1
  Bottom 0.61: MODE1.K 82.55,179.07 R2.1
N$2
  Bottom 0.61: R3.1 MODE2.K
N$3
  Top 0.61: R4.1 85.09,162.56 MODE3.K
N$4
  Bottom 0.61: CVOUT7.P$3 R38.1
N$5
  Top 0.61: R37.1 C19.2 16.51,36.83 R36.2
  Bottom 0.61: IC2.6 R36.2
N$6
  Top 0.61: GATE.K 12.7,168.91 R39.2
N$7
  Top 0.61: LOAD.4 61.01,210.87 R41.1
N$8
  Top 0.61: MODE.3 86.26,198.02 88.9,200.66 R5.2
N$9  (via drill 0.7)
  Top 0.61: v91.44,48.26 v91.44,35.56 | v96.52,35.56 R6.1
  Bottom 0.61: U$1.5 85.09,53.34 87.63,50.8 90.17,49.53 v91.44,48.26 | v91.44,35.56 v96.52,35.56
N$10
  Bottom 0.61: OP1.K R16.2
N$11
  Top 0.61: C2.2 40.64,55.88 38.1,58.42 38.1,60.96 36.83,62.23 IC1.2
  Bottom 0.61: IC1.2 R7.2 R9.1 R8.2
N$12
  Bottom 0.61: R42.1 34.29,210.82 SAVE.4
N$13
  Bottom 0.61: R10.2 30.48,134.62 29.21,133.35 26.67,133.35 25.4,134.62 D8.K
N$14  (via drill 0.7)
  Top 0.61: v86.36,48.26 v86.36,33.02 | v92.71,33.02 R11.1
  Bottom 0.61: v86.36,33.02 v92.71,33.02 | v86.36,48.26 83.82,50.8 U$1.6
N$15
  Top 0.61: C4.2 33.02,73.66 34.29,72.39 IC1.6
  Bottom 0.61: IC1.6 R14.1 R12.2 R13.1
N$16
  Top 0.61: R43.1 85.09,134.62 85.09,137.16 OP.4
N$17
  Bottom 0.61: R15.2 45.72,134.62 44.45,133.35 41.91,133.35 40.64,134.62 D3.K
N$18
  Bottom 0.406: 85.09,185.42 85.09,185.47 MODE.4
  Bottom 0.61: R44.2 83.82,184.15 85.09,185.42
N$19
  Bottom 0.61: R27.2 74.93,133.35 72.39,133.35 71.12,134.62 D1.K
N$20
  Bottom 0.61: OP.3 83.87,149.81 85.09,149.86 R17.2
N$21  (via drill 0.7)
  Top 0.61: v88.9,40.64 R18.1
  Bottom 0.61: U$1.9 77.47,43.18 80.01,40.64 v88.9,40.64
N$22
  Top 0.61: IC1.9 29.21,72.39 30.48,73.66 30.48,77.47 C6.2
  Bottom 0.61: IC1.9 R19.2 R21.1 R20.2
N$24
  Bottom 0.61: R22.2 60.96,134.62 59.69,133.35 57.15,133.35 55.88,134.62 D2.K
N$25
  Bottom 0.61: OP4.K R31.2
N$26  (via drill 0.7)
  Top 0.61: U$1.10 74.93,39.37 v74.93,25.4
  Bottom 0.61: v74.93,25.4 R23.1
N$27
  Top 0.61: C8.2 26.67,55.88 25.4,57.15 25.4,60.96 26.67,62.23 IC1.13
  Bottom 0.61: IC1.13 R24.2 R26.1 R25.2
N$30
  Bottom 0.61: OP2.K R28.2
N$32
  Bottom 0.61: OP3.K R29.2
N$34  (via drill 0.7)
  Top 0.61: v53.34,35.56 v53.34,41.91
  Bottom 0.61: U$1.13 v53.34,35.56 | R30.1 C9.1 31.75,41.91 v53.34,41.91
N$37
  Top 0.61: R32.2 19.05,210.77 SAVE.3
N$41
  Bottom 0.61: LOAD.3 41.96,210.87 R1.2
N$44  (via drill 0.7)
  Top 0.61: U$1.RESET/DAC v63.5,27.94
  Bottom 0.61: IC2.3 39.37,34.29 45.72,27.94 v63.5,27.94
N$45
  Top 0.61: R34.1 38.1,31.75 40.64,29.21 C10.2
  Bottom 0.61: IC2.2 R33.2 R34.1
N$47
  Top 0.61: D7.C R51.2
  Bottom 0.61: R51.2 54.61,96.52 D6.C
N$48
  Top 0.61: D5.A D4.A
  Bottom 0.61: D4.A 44.45,95.25 R35.2
N$71
  Top 0.61: D7.A 60.96,99.06 59.69,100.33 58.42,100.33 X1.9
  Bottom 0.61: X1.10 X1.9
N$72  (via drill 0.7)
  Top 0.61: D4.C v35.56,101.6
  Bottom 0.61: X1.2 X1.1 66.04,100.33 46.99,100.33 45.72,101.6 v35.56,101.6
OP1A
  Bottom 0.61: JP2.11 93.98,45.72 82.55,45.72 80.01,48.26 U$1.7
OP1B  (via drill 0.7)
  Top 0.61: v24.13,154.94 OP1.A
  Bottom 0.61: v24.13,154.94 88.9,154.94 JP1.11
OP2A  (via drill 0.7)
  Top 0.61: v96.52,38.1 JP2.12
  Bottom 0.61: U$1.11 v96.52,38.1
OP2B  (via drill 0.7)
  Top 0.61: v39.37,152.4 OP2.A
  Bottom 0.61: JP1.12 96.52,153.67 95.25,152.4 v39.37,152.4
OP3A  (via drill 0.7)
  Top 0.61: v78.74,35.56 v78.74,71.12 | v96.52,71.12 JP4.1
  Bottom 0.61: U$1.12 v78.74,35.56 | v78.74,71.12 v96.52,71.12
OP3B  (via drill 0.7)
  Top 0.61: v54.61,157.48 OP3.A | JP3.1 96.52,201.93 97.79,186.69 96.52,182.88 96.52,180.34 97.79,179.07 v97.79,173.99 | v78.74,157.48 v78.74,173.99
  Bottom 0.61: v54.61,157.48 v78.74,157.48 | v78.74,173.99 v97.79,173.99
OP4A  (via drill 0.7)
  Top 0.61: v55.88,38.1 v55.88,33.02 | v81.28,33.02 v81.28,68.58 | v93.98,68.58 JP4.2
  Bottom 0.61: U$1.14/A0 v55.88,38.1 | v55.88,33.02 v81.28,33.02 | v81.28,68.58 v93.98,68.58
OP4B  (via drill 0.7)
  Top 0.61: OP4.A 69.85,149.86 73.66,153.67 v73.66,176.53 | JP3.2 93.98,200.66 95.25,191.77 95.25,184.15 93.98,182.88 93.98,180.34 95.25,179.07 v95.25,176.53
  Bottom 0.61: v73.66,176.53 v95.25,176.53
OPA  (via drill 0.7)
  Top 0.61: JP2.10 97.79,50.8 99.06,49.53 v99.06,43.18
  Bottom 0.61: v99.06,43.18 81.28,43.18 78.74,45.72 U$1.8
OPB
  Top 0.61: JP1.10 95.25,161.29 95.25,151.13 81.28,137.16 R43.2 80.01,132.08 C21.1
P1A  (via drill 0.7)
  Top 0.61: v86.36,81.28 v86.36,97.79 | v68.58,55.88 68.58,62.23 64.77,72.39 64.77,74.93 v67.31,81.28
  Bottom 0.61: U$1.21/A7 v68.58,55.88 | v67.31,81.28 v86.36,81.28 | v86.36,97.79 JP4.4
P1B  (via drill 0.7)
  Top 0.61: P1.2 v68.58,180.34 | v78.74,207.01 78.74,194.31 77.47,193.04 77.47,184.15 78.74,182.88 v78.74,180.34
  Bottom 0.61: v68.58,180.34 v78.74,180.34 | JP3.4 92.71,209.55 91.44,208.28 80.01,208.28 v78.74,207.01
P2A  (via drill 0.7)
  Top 0.61: U$1.16/A2 59.69,43.18 58.42,44.45 v58.42,90.17 | v99.06,90.17 99.06,99.06 97.79,100.33 JP4.5
  Bottom 0.61: v58.42,90.17 v99.06,90.17
P2B  (via drill 0.7)
  Top 0.61: v99.06,181.61 99.06,210.82 97.79,212.09 JP3.5 | v76.2,165.1 v76.2,182.88 | P2.2 v53.34,165.1
  Bottom 0.61: v53.34,165.1 v76.2,165.1 | v99.06,181.61 80.01,181.61 78.74,182.88 v76.2,182.88
P3A  (via drill 0.7)
  Top 0.61: v91.44,100.33 v91.44,76.2 | v73.66,46.99 73.66,68.58 76.2,72.39 v76.2,76.2
  Bottom 0.61: v76.2,76.2 v91.44,76.2 | JP4.6 v91.44,100.33 | U$1.17/A3 72.39,45.72 v73.66,46.99
P3B  (via drill 0.7)
  Top 0.61: v91.44,204.47 91.44,210.82 92.71,212.09 JP3.6 | v76.2,204.47 76.2,194.31 73.66,191.77 73.66,179.07 71.12,176.53 v71.12,160.02 | v40.64,160.02 40.64,184.15 38.1,186.69 P3.2
  Bottom 0.61: v40.64,160.02 v71.12,160.02 | v76.2,204.47 v91.44,204.47
P4A  (via drill 0.7)
  Top 0.61: v83.82,83.82 v83.82,104.14 | v66.04,58.42 66.04,62.23 63.5,71.12 63.5,76.2 v66.04,83.82
  Bottom 0.61: U$1.22/A8 v66.04,58.42 | v66.04,83.82 v83.82,83.82 | v83.82,104.14 95.25,104.14 JP4.7
P4B  (via drill 0.7)
  Top 0.61: v86.36,201.93 v86.36,213.36 | P4.2 v24.13,162.56 | v60.96,162.56 v60.96,201.93
  Bottom 0.61: v24.13,162.56 v60.96,162.56 | v60.96,201.93 v86.36,201.93 | v86.36,213.36 95.25,213.36 JP3.7
SAVEA  (via drill 0.7)
  Top 0.61: v58.42,40.64 v58.42,30.48 | v83.82,30.48 v83.82,66.04 | v99.06,66.04 99.06,87.63 97.79,88.9 97.79,96.52 JP4.3
  Bottom 0.61: U$1.15/A1 v58.42,40.64 | v58.42,30.48 v83.82,30.48 | v83.82,66.04 v99.06,66.04
SAVEB  (via drill 0.7)
  Top 0.61: v76.2,209.55 v76.2,207.01
  Bottom 0.61: JP3.3 95.25,210.82 83.82,210.82 v76.2,209.55 | v76.2,207.01 54.61,207.01 53.34,205.74 52.07,205.74 | 52.07,205.74 50.8,205.74 49.53,207.01 R42.2 | C23.2 52.07,205.74

### Text on the board
tPlace: GPIO | gate | CV | CV | CV1 | CV2 | CV3 | CV4 | optional | Teensy 3.2
bPlace: -12V
tDocu: sync | kb | D | R | env | vel | wave | freq | A | S | LFO | os